# EAGLE design Li_Power_Boost_Converter (EAGLE 6.4)
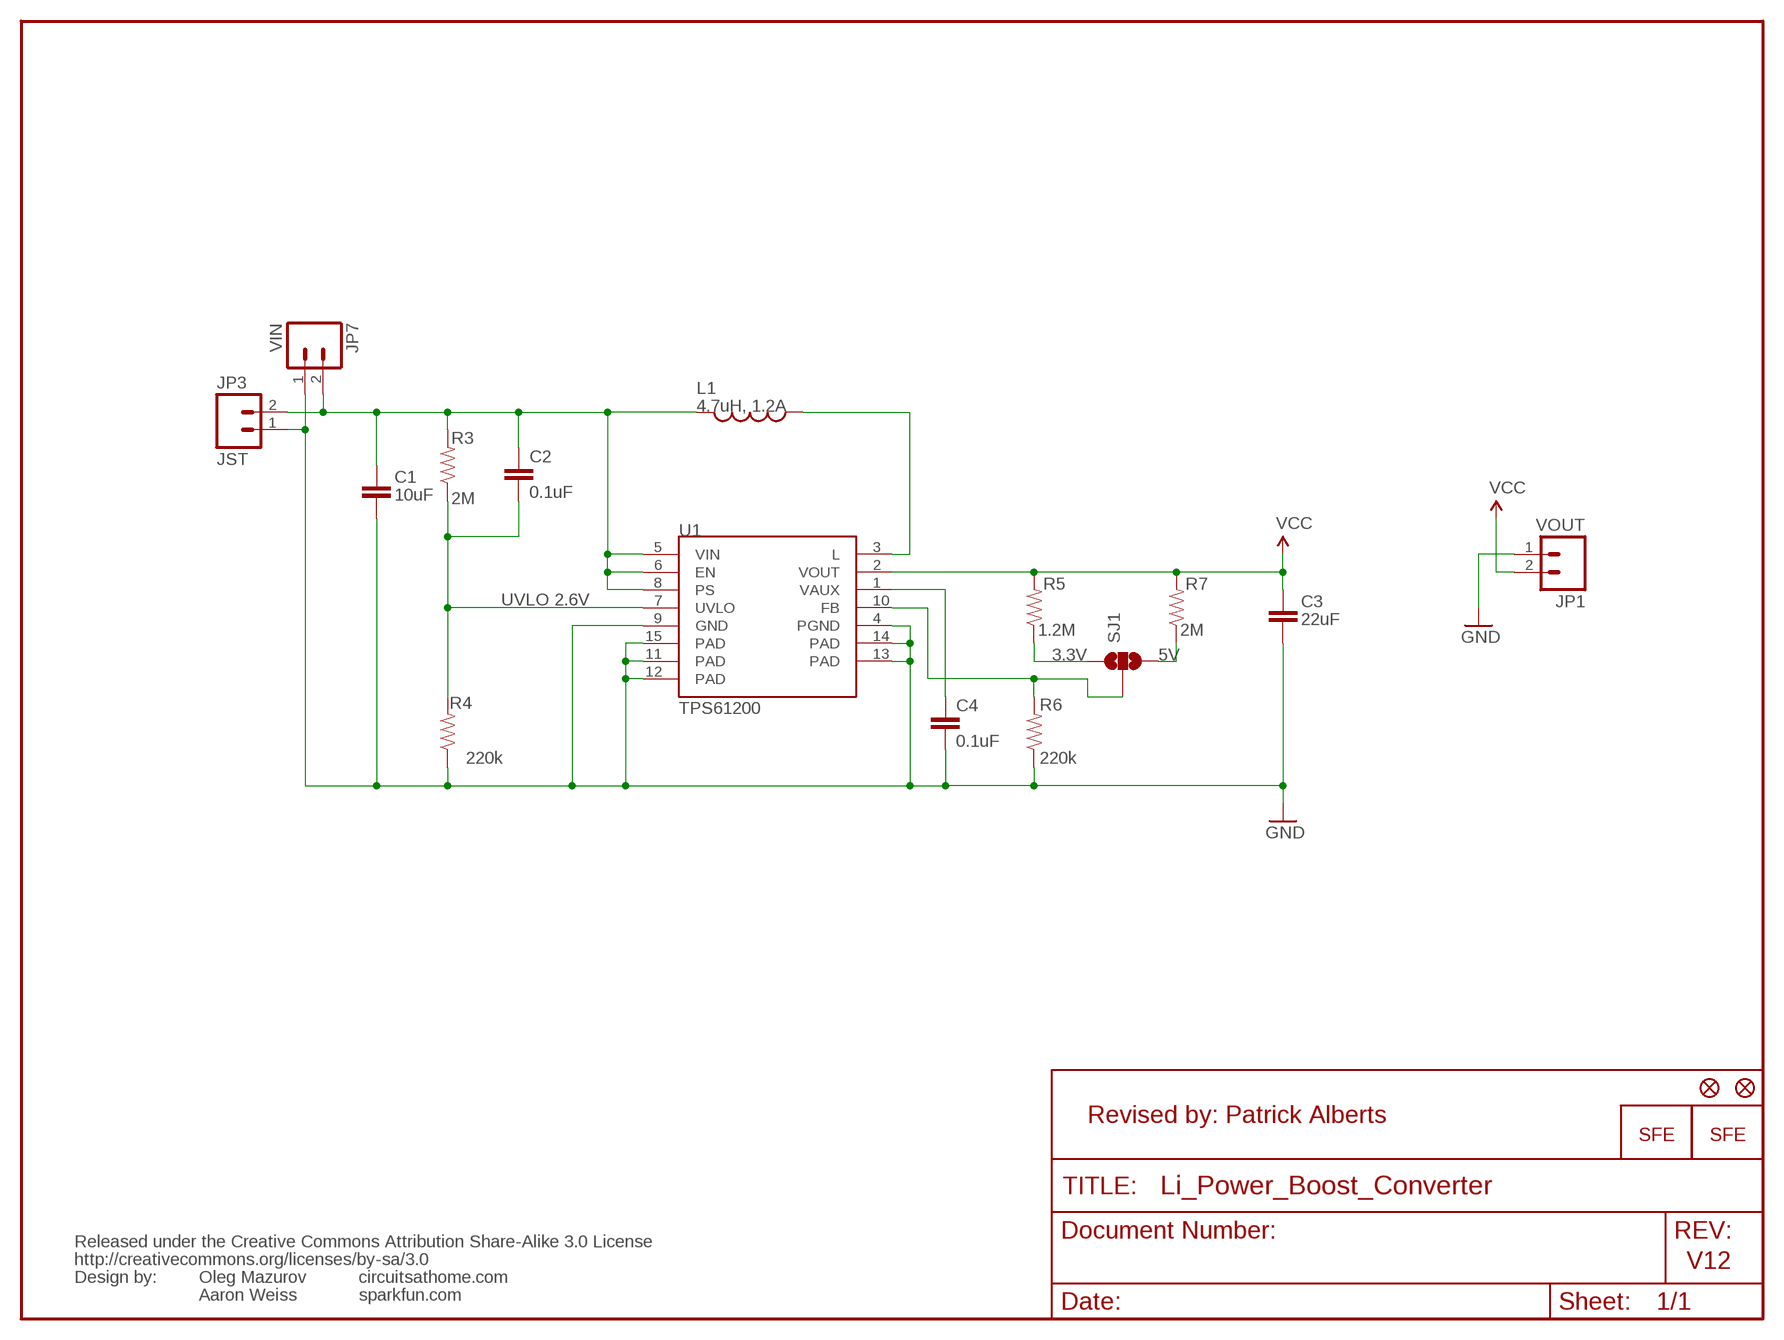
[diagram p0: schematic, sheet 1]

## Parts
C1  10uF  CAP1206  [1206]
C2  0.1uF  CAP0603-CAP  [0603-CAP]
C3  22uF  CAP0805  [0805]
C4  0.1uF  CAP0603-CAP  [0603-CAP]
JP1  VOUT  M02PTH  [1X02]
JP2  LOGO-SFESK  [SFE-LOGO-FLAME]
JP3  JST  M02-JST-2MM-SMT  [JST-2-SMD]
JP4  FIDUCIAL1X2  [FIDUCIAL-1X2]
JP5  FIDUCIAL1X2  [FIDUCIAL-1X2]
JP6  LOGO-SFENEW  [SFE-NEW-WEBLOGO]
JP7  VIN  M02PTH  [1X02]
L1  4.7uH, 1.2A  INDUCTOR.  [CDRH2D09]
R3  2M  RESISTOR0603-RES  [0603-RES]
R4  220k  RESISTOR0603-RES  [0603-RES]
R5  1.2M  RESISTOR0603-RES  [0603-RES]
R6  220k  RESISTOR0603-RES  [0603-RES]
R7  2M  RESISTOR0603-RES  [0603-RES]
SJ1  SOLDERJUMPER_2WAYPASTE2&3  [SJ_3_PASTE2&3]
U1  TPS61200  [QFN-10_PAD]
U$1  CREATIVE_COMMONS  [CREATIVE_COMMONS]

## Nets
3.3V: R5.1 SJ1.1
5V: R7.1 SJ1.3
FB: R6.2 SJ1.2 U1.10(FB)
GND: C1.2 C3.2 C4.2 JP1.1 JP3.1 JP7.1 R4.1 R6.1 U1.4(PGND) U1.9(GND) U1.11(PAD) U1.12(PAD) U1.13(PAD) U1.14(PAD) U1.15(PAD)
N$1: C4.1 U1.1(VAUX)
N$2: L1.P$1 U1.3(L)
UVLO: C2.2 R3.1 R4.2 U1.7(UVLO)
VCC: C3.1 JP1.2 R5.2 R7.2 U1.2(VOUT)
VIN: C1.1 C2.1 JP3.2 JP7.2 L1.P$2 R3.2 U1.5(VIN) U1.6(EN) U1.8(PS)

## Notes on the sheet
- UVLO 2.6V
- Revised by: Patrick Alberts
- V12
- Oleg Mazurov | circuitsathome.com
- Aaron Weiss | sparkfun.com

## Library data of the parts
C1 C3 = CH_passive:CAP: Capacitor Standard 0603 ceramic capacitor, and 0.1" leaded capacitor.
C2 C4 = SparkFun:CAP: Capacitor Standard 0603 ceramic capacitor, and 0.1" leaded capacitor.
JP1 JP3 JP7 = SparkFun:M02: Header 2 Standard 2-pin 0.1" header. Use with straight break away headers (SKU : PRT-00116), right angle break away headers (PRT-00553), swiss pins (PRT-00743), machine pins (PRT-00117), and female headers (PRT-00115). Molex polarized connector foot print use with SKU : PRT-08233 with associated crimp pins and housings.
JP2 JP6 = SparkFun:LOGO-SFE: Spark Fun Electronics PCB Logo This is the standard Spark Fun Electronics PCB logo.
JP4 JP5 = SparkFun:FIDUCIAL: Fiducial Alignment Points Various fiducial points for machine vision alignment.
L1 = SparkFun:INDUCTOR: Inductors Basic Inductor/Choke - 0603 and 1206. Footprints are not proven and vary greatly between part numbers.
R3-R7 = SparkFun:RESISTOR: Resistor Basic schematic elements and footprints for 0603, 1206, and PTH resistors.
SJ1 = SparkFun:SOLDERJUMPER_2WAY: Solder Jumper 2 way solder jumper
U1 = SparkFun:TPS61200: DC to DC Booster
U$1 = SparkFun:CREATIVE_COMMONS

## Board
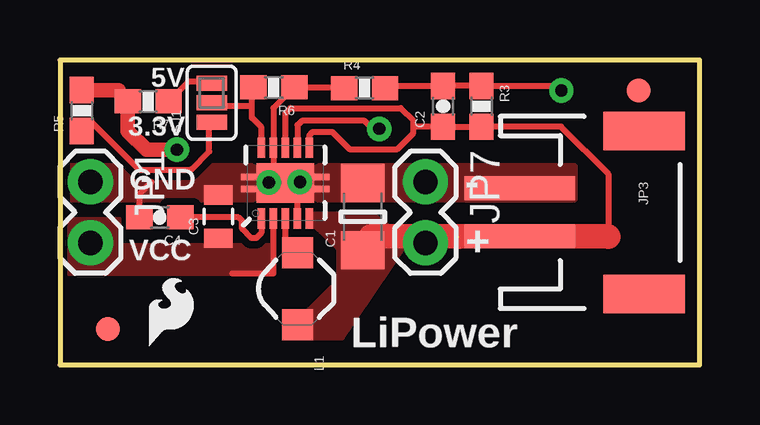
[diagram p1: board, top side]
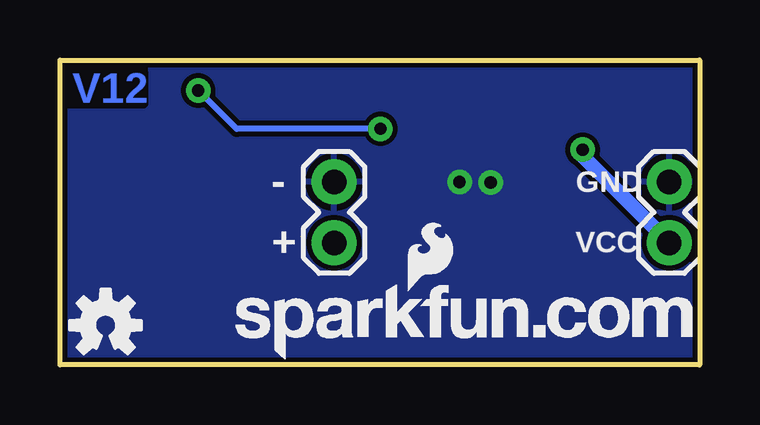
[diagram p2: board, bottom side, seen from below]

Size 26.67 x 12.7 mm. Coordinates in mm from the lower left corner, seen from the top.
Outline: 0,0 26.67,0 26.67,12.7 0,12.7 0,0
Copper layers (1*16): Top 0.035mm / dielectric 1.5mm / Bottom 0.035mm
Design rules "SparkFun *": minimum track width 8mil, minimum drill 20mil, track to track 8mil, track to pad 8mil, pad to pad 8mil, via to via 8mil, smd to smd 8mil, copper to edge 8mil, drill to drill 8mil, minimum pad ring 12mil, minimum via ring 10mil, stop-mask expansion 4mil, vias tented up to drill 20mil, thermal gap 10mil

### Footprints (pad centres in the part's own frame; a part is rotated, then mirrored left to right if it is on the bottom)
1206 = smd 1.6 x 1.8: 1 -1.4,0; 2 1.4,0
0603-CAP = smd 1.1 x 1: 1 -0.85,0; 2 0.85,0
0805 = smd 0.8 x 1.2: 1 -0.9,0; 2 0.9,0
1X02 = drill 1.016 pad 1.88: 1 0,0; 2 2.54,0
JST-2-SMD = smd 1 x 4.6: 1 -1,-3.7; 2 1,-3.7 | smd 1.6 x 3.4: NC1 -3.4,1.5; NC2 3.4,1.5
FIDUCIAL-1X2 = smd 1 x 1: 1 0,0
CDRH2D09 = smd 1.3 x 1.3: P$1 -1.5,0; P$2 1.5,0
0603-RES = smd 1.1 x 1: 1 -0.85,0; 2 0.85,0
SJ_3_PASTE2&3 = smd 0.635 x 1.27: 1 -0.813,0; 2 0,0; 3 0.813,0
QFN-10_PAD = smd 0.297 x 0.85: 1 -1,-1.475; 2 -0.5,-1.475; 3 0,-1.475; 4 0.5,-1.475; 5 1,-1.475; 6 1,1.475; 7 0.5,1.475; 8 0,1.475; 9 -0.5,1.475; 10 -1,1.475 | smd 0.7 x 0.28: 11 -1.5,0.25; 12 -1.5,-0.25; 13 1.5,0.25; 14 1.5,-0.25 | smd 2.4 x 1.65: 15 0,0

### Placement (x,y rotation side)
C1  12.62,6.17 90 top
C2  15.98,10.77 90 top
C3  6.6,6.17 90 top
C4  4.17,6.15 180 top
FRAME1  FRAME-LETTER  [CREATIVE_COMMONS]  21.59,-8.89 0 top  (outside the outline)
JP1  1.27,7.62 270 top
JP2  3.71,0.79 0 top
JP3  22.86,6.35 270 top
JP4  2.01,1.5 0 top
JP5  24.13,11.43 0 top
JP6  19.36,0.21 0 bottom
JP7  15.24,7.62 270 top
L1  9.91,3.17 270 top
R3  17.58,10.77 270 top
R4  12.7,11.53 0 top
R5  0.91,10.59 90 top
R6  8.92,11.56 180 top
R7  3.68,10.97 180 top
SJ1  6.32,10.92 90 top
U1  9.4,7.57 0 top
U$2  [OSHW-LOGO-S]  24.77,1.65 0 bottom

### Tracks (layer width: path | path; a pad name or v marks a point on that pad's centre or on a via)
3.3V
  Top 0.254: R5.1 0.91,9.8 1.27,10.16 3.3,8.13 5.46,8.13 6.22,8.89 6.22,10.01 SJ1.1
5V
  Top 0.254: SJ1.3 6.25,11.81 5.33,11.81 5.33,11.77 R7.1
FB
  Top 0.254: U1.10 8.4,9.89 8,10.29 8,10.85 | 8,10.85 8,11.49 R6.2 | SJ1.2 6.33,10.79 7.95,10.79 8,10.85
GND  (via drill 0.51)
  Top 0.254: U1.4 9.9,7.36 10.16,7.62 | C4.2 3.32,7.13 3.81,7.62 | U1.9 8.89,9.05 | 8.9,8.07 8.89,8.08 8.9,8.09 U1.9 | R4.1 11.82,11.56 R6.1 8.9,10.69 U1.9
  other vias: 8.71,7.59 10.01,7.62
  pour Top (isolate 0.305, no thermals): -0.03,8.31 21.46,8.31 21.46,6.86 0,6.86
  pour Bottom: 0,12.7 0,0 26.67,0 26.67,12.7
N$1
  Top 0.254: 5.07,6.09 C4.1 7.44,6.15 7.59,5.99 7.59,5.66 7.98,5.28 8.18,5.28 8.4,5.5 U1.1
N$2
  Top 0.254: U1.3 9.4,5.16 9.42,5.16 L1.P$1
UVLO  (via drill 0.51)
  Top 0.254: v13.31,9.83 13.03,9.83 12.7,10.16 10.08,10.16 9.91,9.98 9.91,9.05 U1.7 | R4.2 13.64,11.62 C2.2 R3.1 20.71,11.62 v20.9,11.43
  Bottom 0.254: v13.31,9.83 19.3,9.83 v20.9,11.43
VCC  (via drill 0.51)
  Top 0.254: U1.2 8.9,3.82 8.89,3.81 7.18,3.81
  Top 0.61: R5.2 2.44,11.44 2.44,11.37 R7.2 2.83,9.74 3.61,8.97 v4.88,8.97
  Bottom 0.61: JP1.2 4.88,8.69 v4.88,8.97
  pour Top (isolate 0.305, no thermals): 0,4.95 8.89,4.95 8.89,3.81 0,3.81
  pour Top (no thermals): 2.49,3.81 2.49,6.05 0,6.05 0,3.81
VIN  (1 unrouted)
  Top 0.254: 12.97,5.35 12.7,5.08 | 10.4,8.87 U1.6 10.4,9.56 10.54,9.7 11.35,9.7 12.06,8.99 14.07,8.99 14.73,9.65 14.73,9.92 | JP7.2 16.24,5.08 16.51,5.35 | 9.4,10.26 U1.8 9.4,10.49 9.6,10.69 14.2,10.69 14.73,10.16 14.73,9.92 | 22.86,5.33 22.86,7.95 20.89,9.92 R3.2 C2.1 14.73,9.92
  Top 1.016: 12.97,5.35 16.51,5.35 22.84,5.35 22.86,5.33 | 16.64,5.33 JP3.2
  pour Top (isolate 0.305, no thermals): 10.36,1.14 11.76,1.14 14.27,4.85 14.27,5.71 13.72,5.71 13.03,6.25 10.52,6.25 10.39,6.3 10.39,5.79 10.64,5.79 11.63,4.83 11.63,3.51 10.36,2.24

### Text on the board
Bottom: V12
tPlace: 5V | 3.3V | GND | - | + | VCC | LiPower
bPlace: GND | - | VCC | +
tNames: Oleg Mazurov circuitsathome.com | Aaron Weiss Sparkfun.com